# EAGLE design LFO (EAGLE 9.6.2)
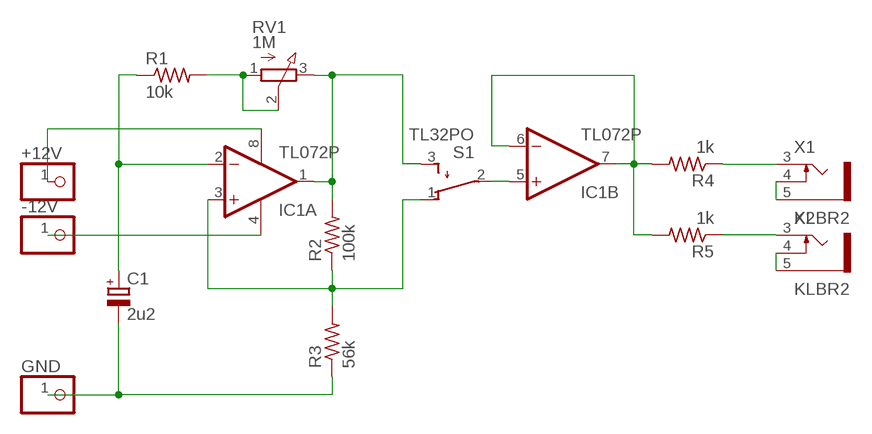
[diagram p0: schematic, sheet 1]

## Parts
+12V  PINHD-1X1  [1X01]
-12V  PINHD-1X1  [1X01]
C1  2u2  CPOL-EUE2,5-6E  [E2,5-6E]
GND  PINHD-1X1  [1X01]
IC1  TL072P  [DIL08]
R1  10k  R-US_0204/7  [0204/7]
R2  100k  R-US_0204/7  [0204/7]
R3  56k  R-US_0204/7  [0204/7]
R4  1k  R-US_0204/7  [0204/7]
R5  1k  R-US_0204/7  [0204/7]
RV1  1M  3RP/1610N  [3RP/1610N]
S1  TL32PO  [TL3XPO]
X1  KLBR2  [KLBR2]
X2  KLBR2  [KLBR2]

## Nets
N$1: R1.2 RV1.1(A) RV1.2(S)
N$2: IC1.1(A:OUT) R2.2 RV1.3(E) S1.3(S)
N$3: IC1.3(A:+IN) R2.1 R3.2 S1.1(O)
N$4: C1.+ IC1.2(A:-IN) R1.1
N$5: C1.- GND.1 R3.1
N$6: IC1.5(B:+IN) S1.2(P)
N$7: IC1.6(B:-IN) IC1.7(B:OUT) R4.2 R5.2
N$8: R5.1 X2.3
N$9: X1.4 X1.5
N$10: X2.4 X2.5
N$11: R4.1 X1.3
N$12: +12V.1 IC1.8(P:V+)
N$13: -12V.1 IC1.4(P:V-)

## Library data of the parts
+12V -12V GND = pinhead:PINHD-1X1: PIN HEADER
C1 = rcl:CPOL-EU: POLARIZED CAPACITOR, European symbol; SPICEPREFIX: C
IC1 = linear:TL072: OP AMP
R1-R5 = rcl:R-US_: RESISTOR, American symbol; SPICEPREFIX: R
RV1 = pot:3RP/1610N: 16mm Potentiometer one level Source: http://www.alphapotentiometers.net/html/16mm_pot_2.html
S1 = switch:TL32PO: TINY SWITCH ON - MOM Source: http://www2.produktinfo.conrad.com/datenblaetter/700000-724999/705152-da-01-de-Subminiaturschalter_TL_36YO.pdf
X1 X2 = con-lumberg:KLBR?: Jack connectors according to JISC 6560, 2.5mm / 3.5 mm Klinkensteckverbinder nach JISC 6560, 2.5mm / 3,5 mm Source: http://www.lumberg.com/Produkte/PDFs/KLBR2.pdf www.lumberg.com/Produkte/PDFs/KLBR1.pdf; OC_FARNELL: unknown; OC_NEWARK: unknown

## Board
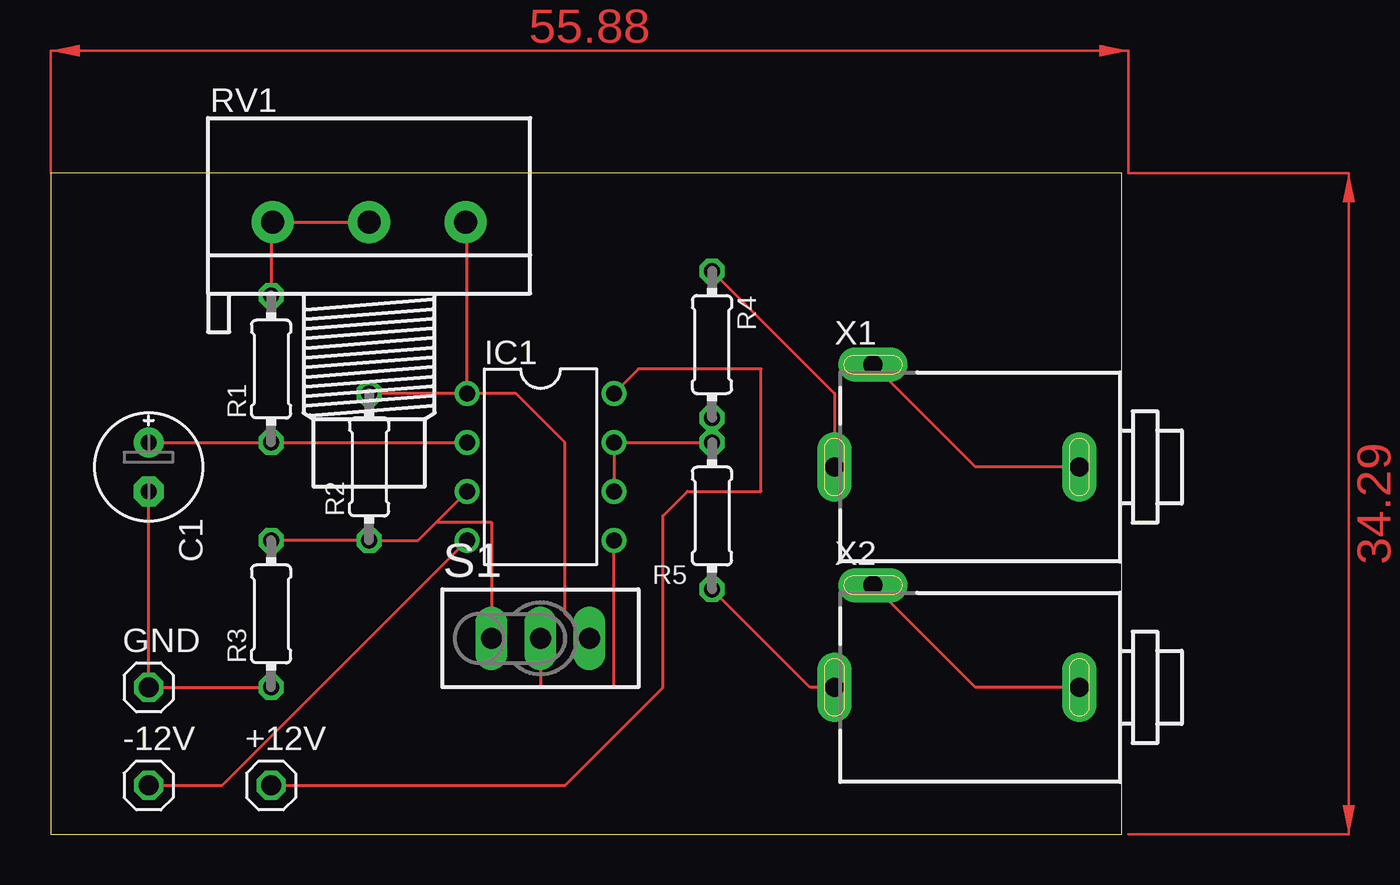
[diagram p1: board, top side]
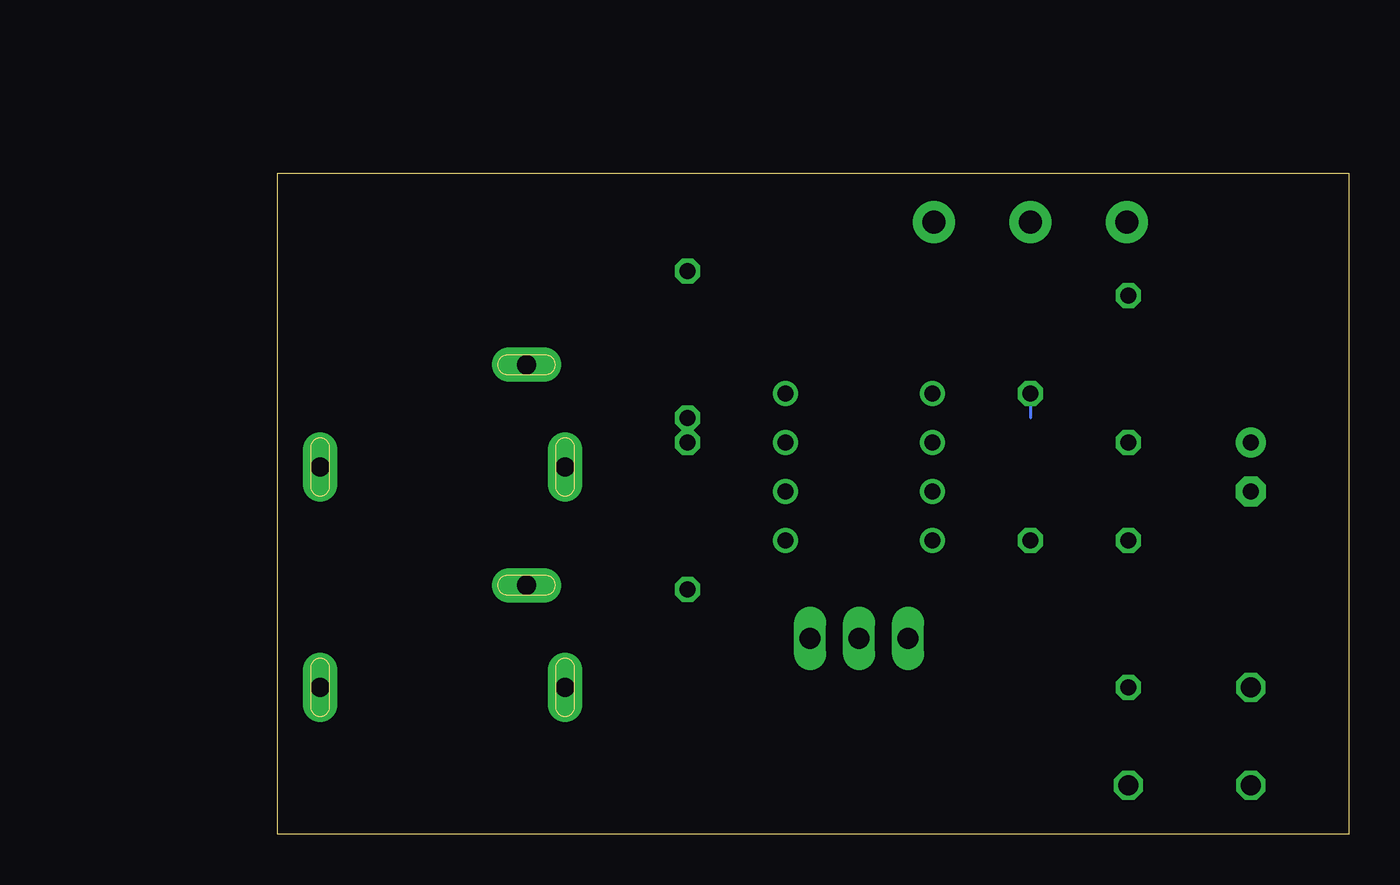
[diagram p2: board, bottom side, seen from below]

Size 55.55 x 34.28 mm. Coordinates in mm from the lower left corner, seen from the top.
Outline: 0,0 55.55,0 55.55,34.28 0,34.28 0,0
Copper layers (1*16): Top 0.035mm / dielectric 1.5mm / Bottom 0.035mm
Design rules "default": minimum track width 6mil, minimum drill 0.35mm, track to track 6mil, track to pad 6mil, pad to pad 6mil, via to via 6mil, smd to smd 6mil, copper to edge 40mil, drill to drill 6mil, minimum pad ring 10mil, minimum via ring 8mil, stop-mask expansion 4mil, vias tented up to drill 0mil, thermal gap 10mil

### Footprints (pad centres in the part's own frame; a part is rotated, then mirrored left to right if it is on the bottom)
1X01 = drill 1.016 octagon: 1 0,0
E2,5-6E = drill 0.813 pad 1.575: + -1.27,0 | drill 0.813 pad 1.575 octagon: - 1.27,0
DIL08 = drill 0.813 pad 1.27: 1 -3.81,-3.81; 2 -1.27,-3.81; 3 1.27,-3.81; 4 3.81,-3.81; 5 3.81,3.81; 6 1.27,3.81; 7 -1.27,3.81; 8 -3.81,3.81
0204/7 = drill 0.813 octagon: 1 -3.81,0; 2 3.81,0
3RP/1610N = drill 1.2 pad 2.184: 1 -5,0; 2 0,0; 3 5,0
TL3XPO = drill 1.1 pad 1.422 long: 1 -2.54,0; 2 0,0; 3 2.54,0
KLBR2 = drill 1 pad 1.8 long: 3 0,-6.35; 4 -5.3,-4.35; 5 0,6.35

### Placement (x,y rotation side)
+12V  11.43,2.54 0 top
-12V  5.08,2.54 0 top
C1  5.08,19.05 270 top
GND  5.08,7.62 0 top
IC1  25.4,19.05 270 top
R1  11.43,24.13 90 top
R2  16.51,19.05 90 top
R3  11.43,11.43 90 top
R4  34.29,25.4 270 top
R5  34.29,16.51 90 top
RV1  16.51,31.75 0 top
S1  25.4,10.16 0 top
X1  46.99,19.05 270 top
X2  46.99,7.62 270 top

### Tracks (layer width: path | path; a pad name or v marks a point on that pad's centre or on a via)
N$1
  Top 0.152: R1.2 11.43,31.75 RV1.1 RV1.2
N$2
  Top 0.152: IC1.1 R2.2 | IC1.1 21.59,31.75 RV1.3 | S1.3 26.67,11.43 26.67,20.32 24.13,22.86 IC1.1
  Bottom 0.152: R2.2 16.51,21.59
N$3
  Top 0.152: R3.2 R2.1 19.05,15.24 20,16.19 | 20,16.19 IC1.3 | S1.1 22.86,16.19 20,16.19
N$4
  Top 0.152: C1.+ R1.1 IC1.2
N$5
  Top 0.152: R3.1 GND.1 C1.-
N$6
  Top 0.152: 25.4,11.43 S1.2 25.4,7.62 29.21,7.62 IC1.5
N$7
  Top 0.152: R4.2 R5.2 IC1.7 IC1.6
N$8
  Top 0.152: X2.3 39.37,7.62 R5.1
N$9
  Top 0.152: X1.5 47.94,19.05 42.86,24.13 42.86,24.57 X1.4
N$10
  Top 0.152: X2.5 47.94,7.62 42.86,12.7 42.86,13.14 X2.4
N$11
  Top 0.152: R4.1 40.64,22.86 X1.3
N$12
  Top 0.152: IC1.8 30.48,24.13 36.83,24.13 36.83,17.78 33.02,17.78 31.75,16.51 31.75,7.62 26.67,2.54 +12V.1
N$13
  Top 0.152: IC1.4 8.89,2.54 -12V.1
(copper drawn outside any net)
  shapes: Top area x2